# EAGLE design navscreen_r0 (EAGLE 6.5.0)
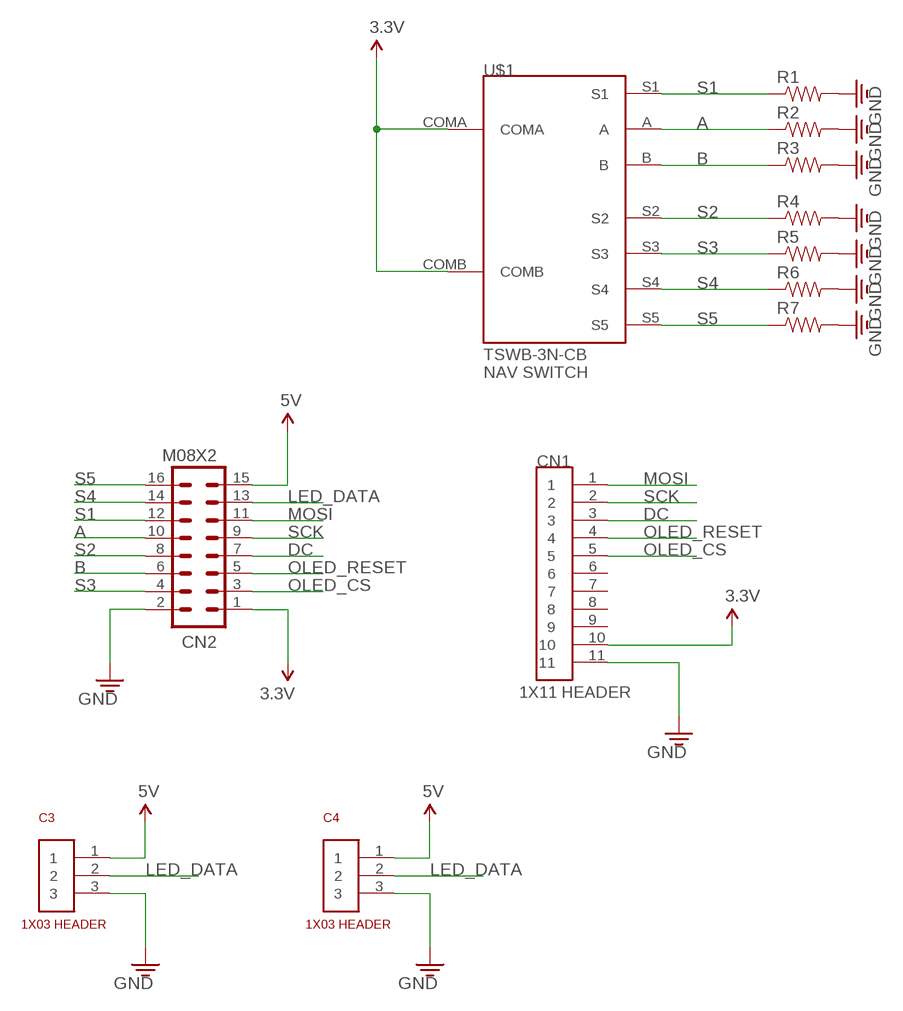
[diagram p0: schematic, sheet 1]

## Parts
C3  1X03  [1X03]
C4  1X03  [1X03]
CN1  1X11  [1X11]
CN2  M08X2  [2X8]
R1  RESISTOR0603  [0603]
R2  RESISTOR0603  [0603]
R3  RESISTOR0603  [0603]
R4  RESISTOR0603  [0603]
R5  RESISTOR0603  [0603]
R6  RESISTOR0603  [0603]
R7  RESISTOR0603  [0603]
U$1  NAV-SWITCH-TSWB-3N-CB  [TSWB-3N-CB]

## Nets
3.3V: CN1.10 CN2.1 U$1.COMA U$1.COMB
5V: C3.1 C4.1 CN2.15
A: CN2.10 R2.1 U$1.A
B: CN2.6 R3.1 U$1.B
DC: CN1.3 CN2.7
GND: C3.3 C4.3 CN1.11 CN2.2 R1.2 R2.2 R3.2 R4.2 R5.2 R6.2 R7.2
LED_DATA: C3.2 C4.2 CN2.13
MOSI: CN1.1 CN2.11
OLED_CS: CN1.5 CN2.3
OLED_RESET: CN1.4 CN2.5
S1: CN2.12 R1.1 U$1.S1
S2: CN2.8 R4.1 U$1.S2
S3: CN2.4 R5.1 U$1.S3
S4: CN2.14 R6.1 U$1.S4
S5: CN2.16 R7.1 U$1.S5
SCK: CN1.2 CN2.9
Unconnected: CN1.6 CN1.7 CN1.8 CN1.9

## Library data of the parts
C3 C4 = openct:1X03
CN1 = openct:1X11
CN2 = SparkFun-Connectors:M08X2: .1" headers, two rows of 8 each
R1-R7 = openct:RESISTOR: Resistor Basic schematic elements and footprints for 0603, 1206, and PTH 1/10th watt (small) resistors.
U$1 = openct:NAV-SWITCH-TSWB-3N-CB: C&K TSWB3NCB 4-way Navigation Switch w/Scroll wheel and Select Switch

## Board
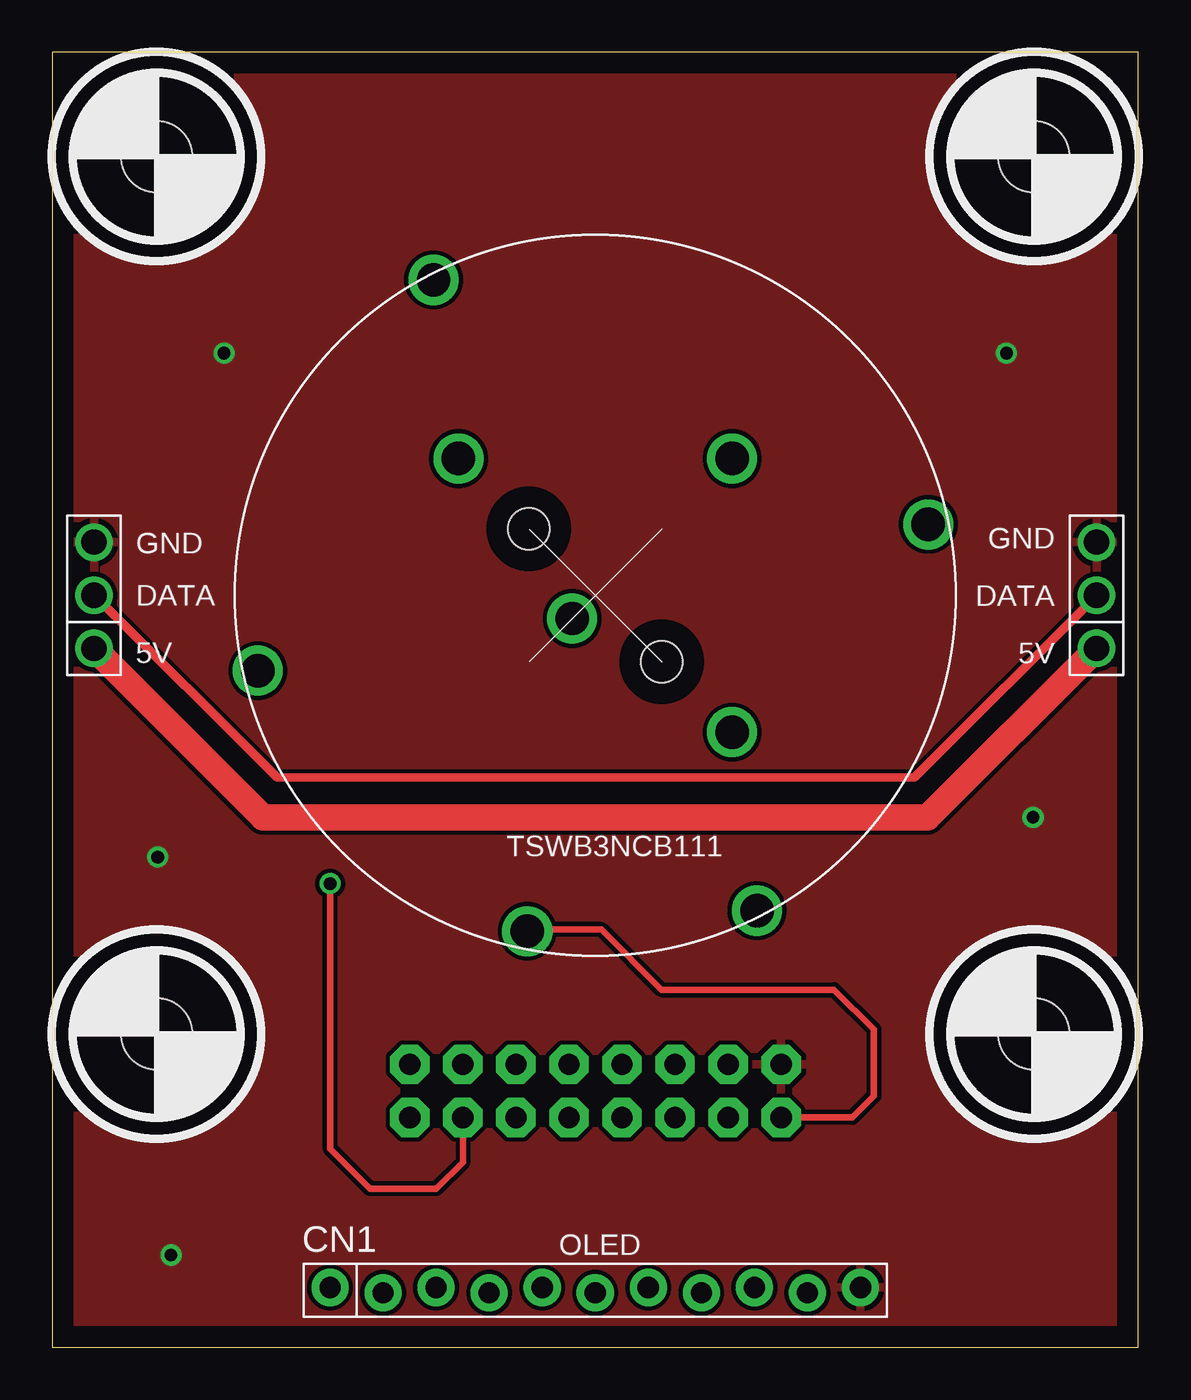
[diagram p1: board, top side]
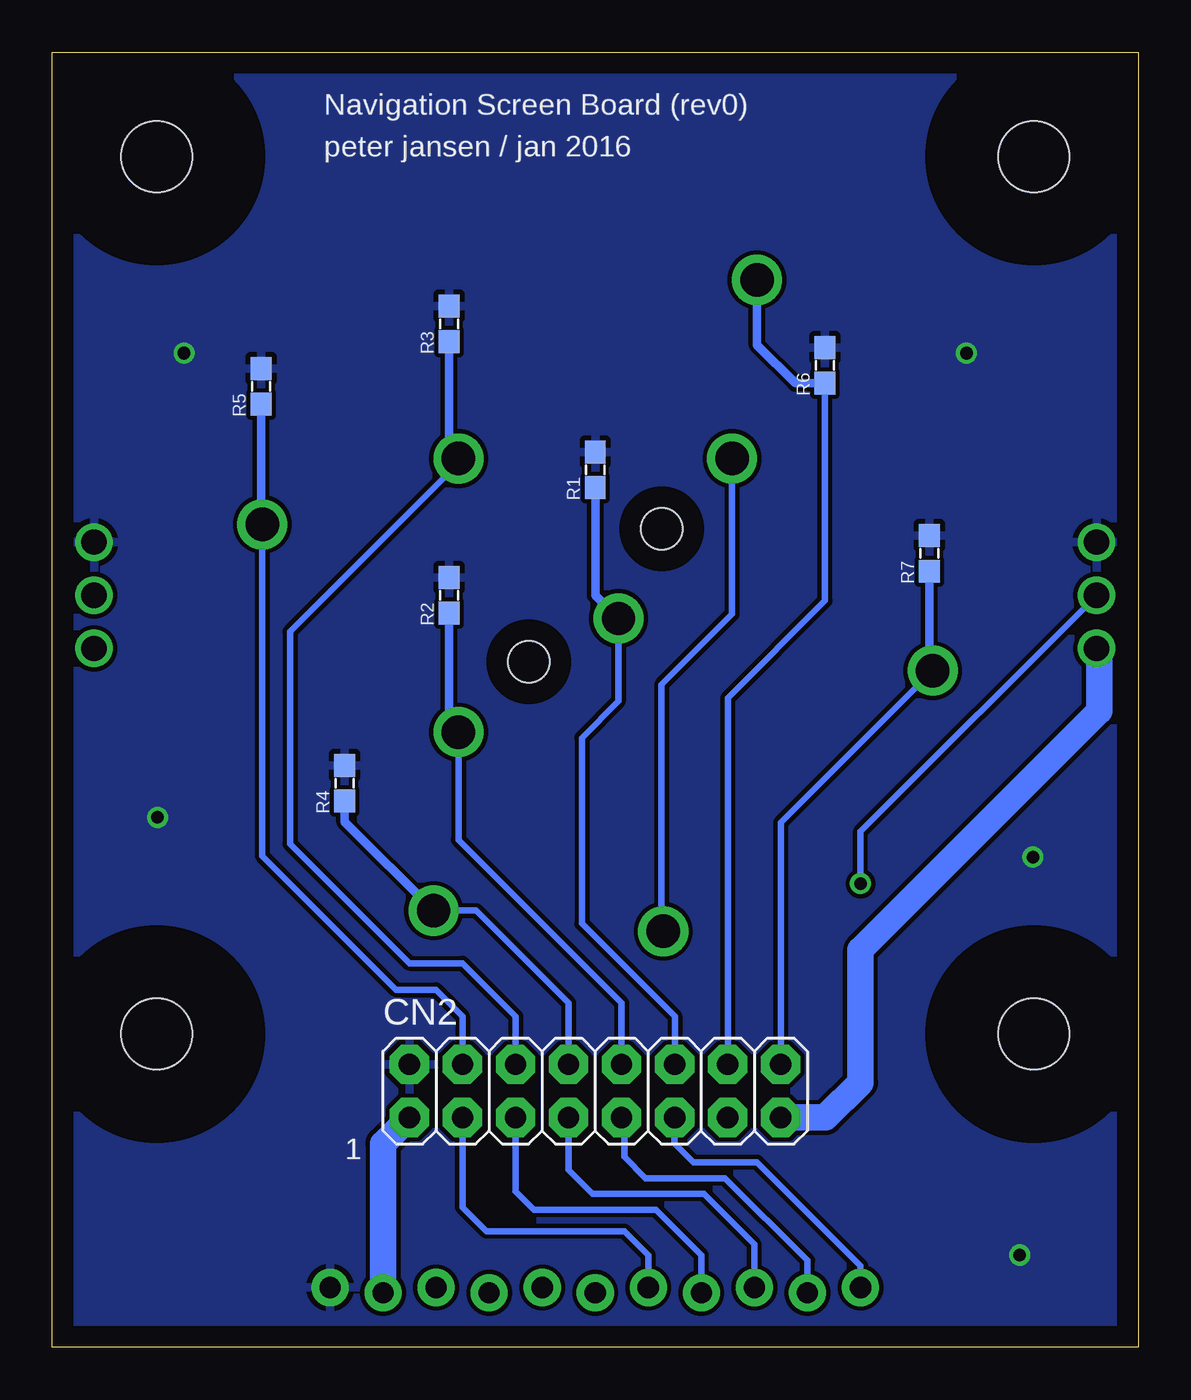
[diagram p2: board, bottom side, seen from below]

Size 52 x 62 mm. Coordinates in mm from the lower left corner, seen from the top.
Outline: 0,0 52,0 52,62 0,62 0,0
Copper layers (1*16): Top 0.035mm / dielectric 1.5mm / Bottom 0.035mm
Design rules "default": minimum track width 10mil, minimum drill 24mil, track to track 8mil, track to pad 8mil, pad to pad 8mil, via to via 8mil, smd to smd 8mil, copper to edge 40mil, drill to drill 8mil, minimum pad ring 10mil, minimum via ring 8mil, stop-mask expansion 4mil, vias tented up to drill 0mil, thermal gap 10mil
Holes 3.4 mm at 5,57 47,57 47,15 5,15
tRestrict: area 0,52 to 10,62; area 42,52 to 52,62; area 42,10 to 52,20; area 0,10 to 10,20
bRestrict: area 0,10 to 10,20; area 42,10 to 52,20; area 42,52 to 52,62; area 0,52 to 10,62

### Footprints (pad centres in the part's own frame; a part is rotated, then mirrored left to right if it is on the bottom)
1X03 = drill 1.2: 1 -2.54,0; 2 0,0; 3 2.54,0
1X11 = drill 1.016 pad 1.778: 1 -12.7,0.127; 2 -10.16,-0.127; 3 -7.62,0.127; 4 -5.08,-0.127; 5 -2.54,0.127; 6 0,-0.127; 7 2.54,0.127; 8 5.08,-0.127; 9 7.62,0.127; 10 10.16,-0.127; 11 12.7,0.127
2X8 = drill 1.016 pad 1.88 octagon: 1 0,0; 2 0,2.54; 3 2.54,0; 4 2.54,2.54; 5 5.08,0; 6 5.08,2.54; 7 7.62,0; 8 7.62,2.54; 9 10.16,0; 10 10.16,2.54; 11 12.7,0; 12 12.7,2.54; 13 15.24,0; 14 15.24,2.54; 15 17.78,0; 16 17.78,2.54
0603 = smd 1.1 x 1: 1 -0.85,0; 2 0.85,0
TSWB-3N-CB = drill 1.6: A 6.548,-6.548; B 6.548,6.548; COMA -6.548,6.548; COMB -3.253,-16.087; S1 -1.11,-1.11; S2 7.743,-15.097; S3 15.945,3.394; S4 -7.743,15.097; S5 -16.157,-3.606 | hole 2: -3.182,3.182; 3.182,-3.182

### Placement (x,y rotation side)
C3  2,36 90 top
C4  50,36 90 top
CN1  26,2.73 0 top
CN2  34.9,11 0 bottom
R1  26,42 90 bottom
R2  33,36 90 bottom
R3  33,49 90 bottom
R4  38,27 90 bottom
R5  42,46 90 bottom
R6  15,47 90 bottom
R7  10,38 90 bottom
U$1  26,36 0 top

### Tracks (layer width: path | path; a pad name or v marks a point on that pad's centre or on a via)
3.3V
  Top 0.305: CN2.1 38.3,11 39.34,12.04 39.34,15.21 37.44,17.11 29.18,17.11 26.3,20 22.83,20 U$1.COMB
  Bottom 0.305: U$1.COMA 19.45,35.1 22.83,31.72 22.83,20 U$1.COMB
  Bottom 1.27: CN2.1 36.16,9.74 CN1.10
5V
  Top 1.27: C3.1 10.09,25.37 41.91,25.37 C4.1
  Bottom 1.27: CN2.15 14.98,11 13.3,12.67 13.3,19.02 1.88,30.45 1.88,33.34 C3.1
A
  Bottom 0.305: U$1.A 32.55,24.29 24.73,16.48 CN2.10
  Bottom 0.406: U$1.A 33,29.9 R2.1
B
  Bottom 0.305: U$1.B 32.55,42.32 40.61,34.26 40.61,24.1 34.9,18.38 32.35,18.38 29.81,15.84 CN2.6
  Bottom 0.406: U$1.B 33,43 R3.1
DC
  Bottom 0.305: CN1.3 18.38,4.92 20.8,7.34 26.13,7.34 27.28,8.48 CN2.7
GND  (via drill 0.6)
  other vias: 5.05,23.47 5.68,4.41 46.96,25.37 8.23,47.59 45.69,47.59
  pour Top: 0,62 0,0 52,0 52,62
  pour Bottom: 0,62 0,0 52,0 52,62
LED_DATA  (via drill 0.6)
  Top 0.305: CN2.13 19.66,8.86 18.38,7.59 15.21,7.59 13.3,9.5 v13.3,22.2
  Top 0.406: C3.2 2.04,36 10.77,27.27 41.27,27.27 C4.2
  Bottom 0.305: v13.3,22.2 13.3,24.7 C3.2
MOSI
  Bottom 0.305: CN1.1 13.3,3.9 18.26,8.86 21.31,8.86 22.2,9.75 CN2.11
OLED_CS
  Bottom 0.305: CN1.5 23.46,4.41 24.61,5.56 31.21,5.56 32.36,6.71 CN2.3
OLED_RESET
  Bottom 0.305: CN1.4 20.92,4.41 23.08,6.57 28.93,6.57 29.82,7.47 CN2.5
S1
  Bottom 0.305: U$1.S1 24.89,30.93 26.64,29.18 26.64,20.29 22.2,15.84 CN2.12
  Bottom 0.406: U$1.S1 26,36 R1.1
S2
  Bottom 0.305: U$1.S2 31.7,20.9 27.27,16.48 CN2.8
  Bottom 0.406: U$1.S2 38,25.16 R4.1
S3
  Bottom 0.305: U$1.S3 41.95,23.53 35.53,17.11 33.62,17.11 32.35,15.84 CN2.4
  Bottom 0.406: U$1.S3 42,39.45 R5.1
S4
  Bottom 0.305: CN2.14 19.66,31.08 15,35.74 R6.1
  Bottom 0.406: R6.1 16.42,46.15 18.26,47.98 U$1.S4
S5
  Bottom 0.305: CN2.16 17.12,25.12 U$1.S5
  Bottom 0.406: U$1.S5 10,32.39 R7.1
SCK
  Bottom 0.305: CN1.2 15.84,4.16 19.78,8.1 23.59,8.1 24.61,9.11 24.61,10.87 CN2.9

### Text on the board
tPlace: GND | GND | DATA | DATA | 5V | 5V | TSWB3NCB111 | OLED
bPlace: Navigation Screen Board (rev0) | peter jansen / jan 2016 | 1